# EAGLE design W032B (EAGLE 6.6.0)
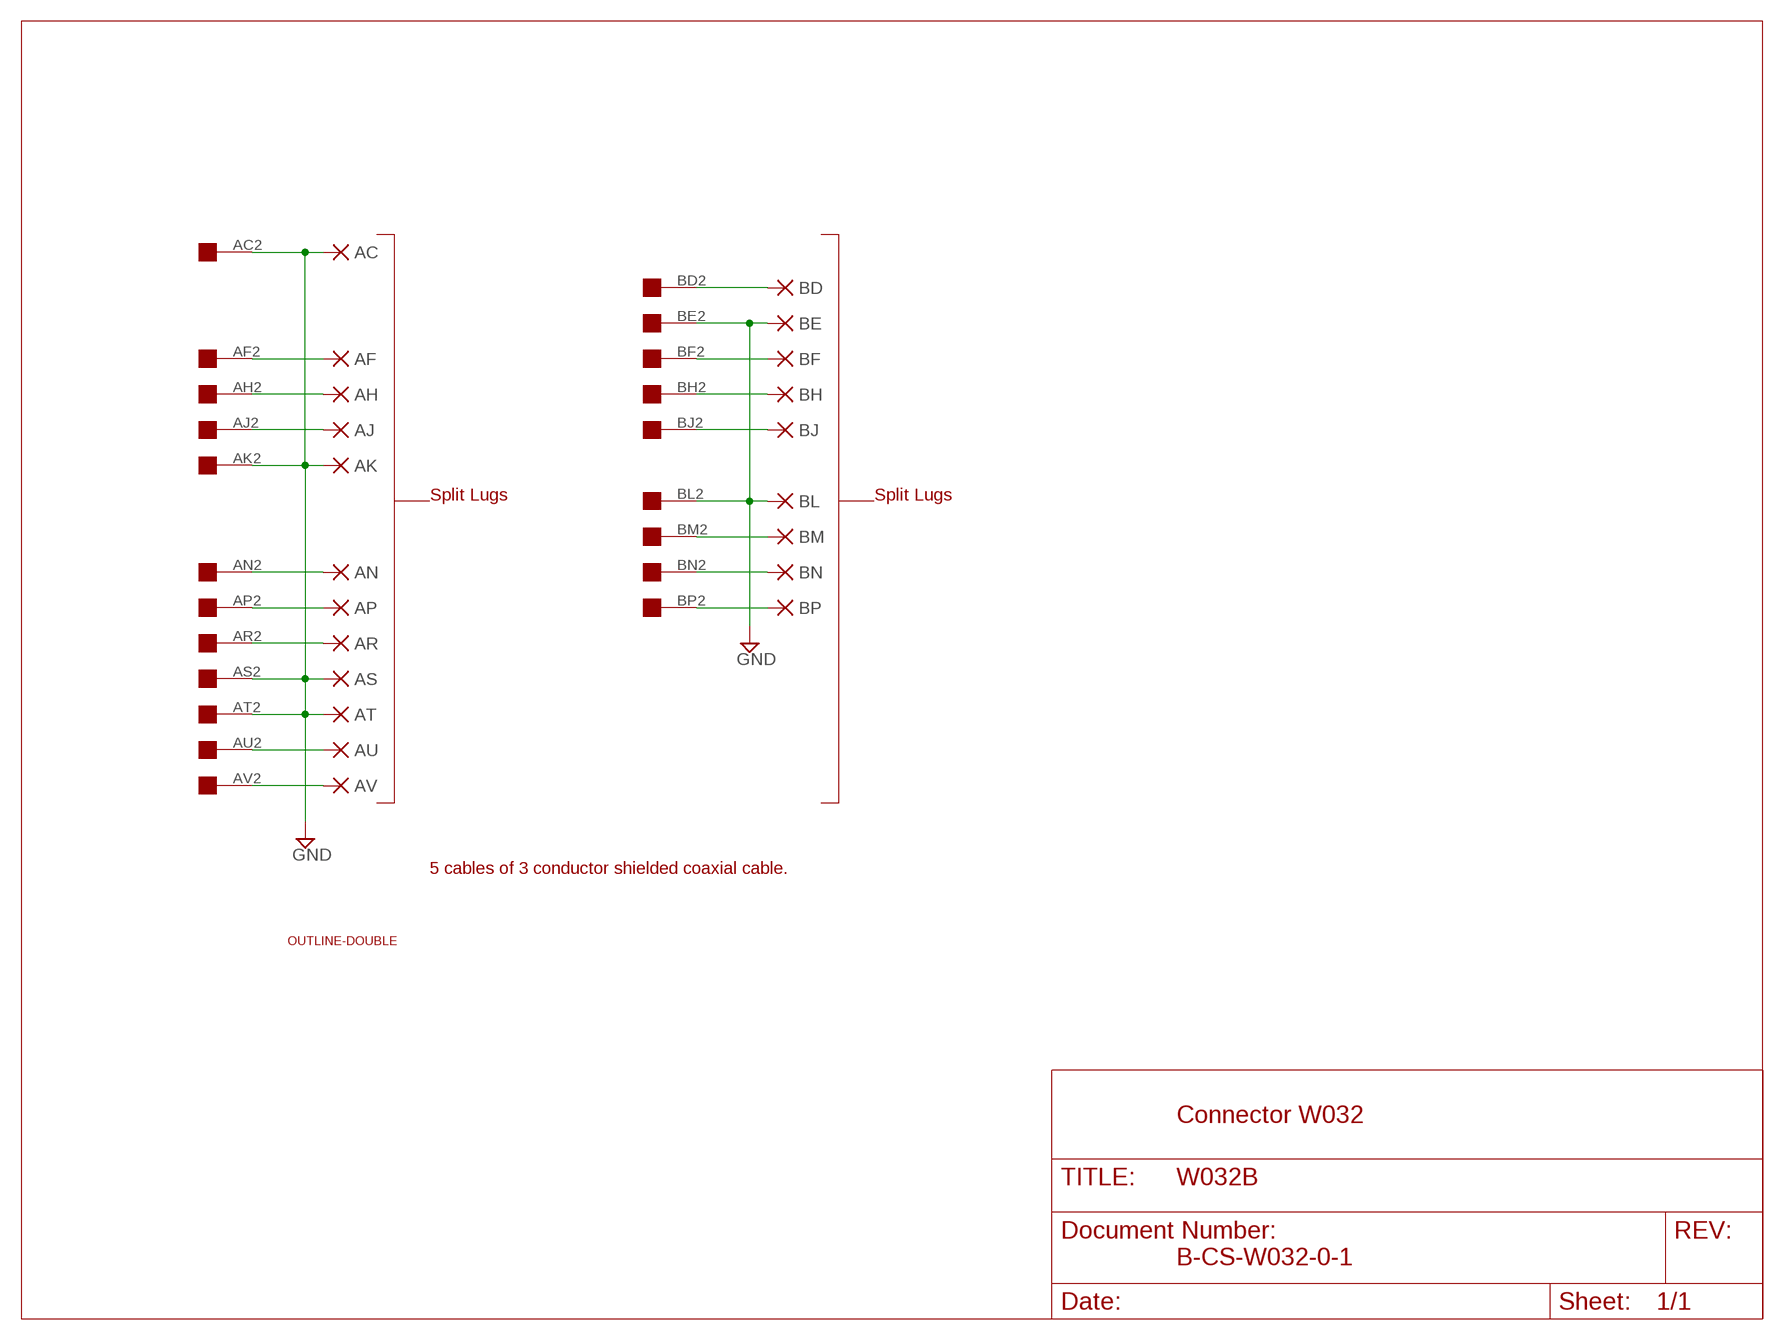
[diagram p0: schematic, sheet 1]

## Parts
AC  PAD-0465  [0465]
AF  PAD-0465  [0465]
AH  PAD-0465  [0465]
AJ  PAD-0465  [0465]
AK  PAD-0465  [0465]
AN  PAD-0465  [0465]
AP  PAD-0465  [0465]
AR  PAD-0465  [0465]
AS  PAD-0465  [0465]
AT  PAD-0465  [0465]
AU  PAD-0465  [0465]
AV  PAD-0465  [0465]
BD  PAD-0465  [0465]
BE  PAD-0465  [0465]
BF  PAD-0465  [0465]
BH  PAD-0465  [0465]
BJ  PAD-0465  [0465]
BL  PAD-0465  [0465]
BM  PAD-0465  [0465]
BN  PAD-0465  [0465]
BP  PAD-0465  [0465]
U$1  OUTLINE-DOUBLE  [DOUBLE]
U$3  DOUBLE  [EDGE-CON4]

## Nets
GND: AC.P$1(P) AK.P$1(P) AS.P$1(P) AT.P$1(P) BE.P$1(P) BL.P$1(P) U$3.AC2 U$3.AK2 U$3.AS2 U$3.AT2 U$3.BE2 U$3.BL2
N$2: BH.P$1(P) U$3.BH2
N$4: BM.P$1(P) U$3.BM2
N$5: BP.P$1(P) U$3.BP2
N$9: BD.P$1(P) U$3.BD2
N$14: AH.P$1(P) U$3.AH2
N$15: BF.P$1(P) U$3.BF2
N$16: BJ.P$1(P) U$3.BJ2
N$18: BN.P$1(P) U$3.BN2
N$23: AP.P$1(P) U$3.AP2
N$29: AF.P$1(P) U$3.AF2
N$30: AJ.P$1(P) U$3.AJ2
N$32: AN.P$1(P) U$3.AN2
N$33: AR.P$1(P) U$3.AR2
N$34: AU.P$1(P) U$3.AU2
N$35: AV.P$1(P) U$3.AV2
Unconnected: U$3.AA1 U$3.AA2 U$3.AB1 U$3.AB2 U$3.AC1 U$3.AD1 U$3.AD2 U$3.AE1 U$3.AE2 U$3.AF1 U$3.AH1 U$3.AJ1 U$3.AK1 U$3.AL1 U$3.AL2 U$3.AM1 U$3.AM2 U$3.AN1 U$3.AP1 U$3.AR1 U$3.AS1 U$3.AT1 U$3.AU1 U$3.AV1 U$3.BA1 U$3.BA2 U$3.BB1 U$3.BB2 U$3.BC1 U$3.BC2 U$3.BD1 U$3.BE1 U$3.BF1 U$3.BH1 U$3.BJ1 U$3.BK1 U$3.BK2 U$3.BL1 U$3.BM1 U$3.BN1 U$3.BP1 U$3.BR1 U$3.BR2 U$3.BS1 U$3.BS2 U$3.BT1 U$3.BT2 U$3.BU1 U$3.BU2 U$3.BV1 U$3.BV2

## Notes on the sheet
- Split Lugs | Split Lugs
- 5 cables of 3 conductor shielded coaxial cable.
- Connector W032
- B-CS-W032-0-1

## Library data of the parts
AC AF AH AJ AK AN AP AR AS AT AU AV BD BE BF BH BJ BL BM BN BP = dec-con:PAD: WIRE PAD Standard US Drill Sizes
U$1 = dec-con:OUTLINE-*: Board outlines for DEC boards.
U$3 = dec-con:DOUBLE: Double-Height DEC board

## Net classes
1 Supply: width 0.813 mm

## Board
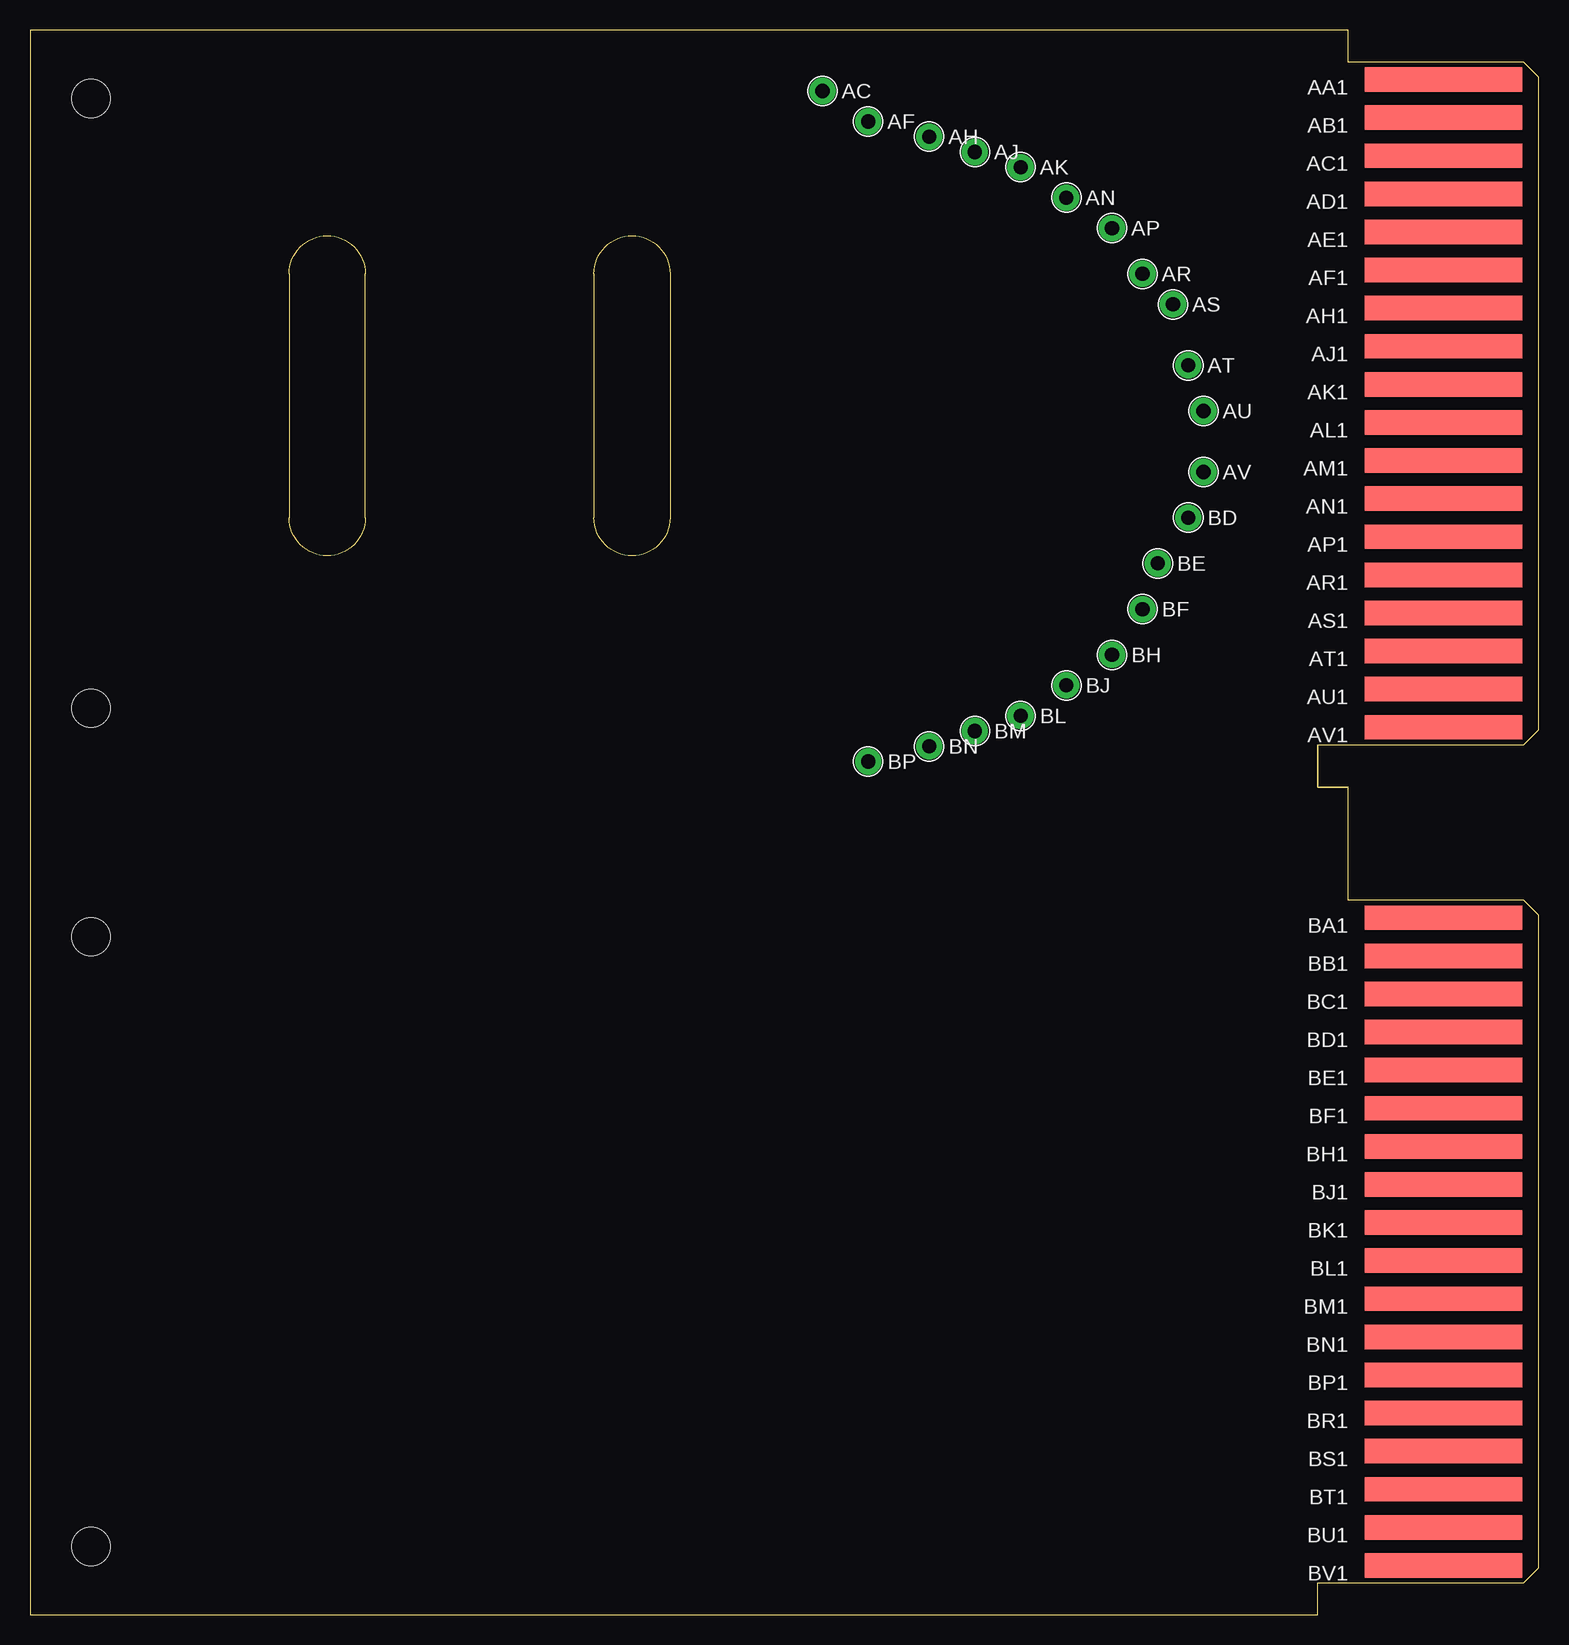
[diagram p1: board, top side]
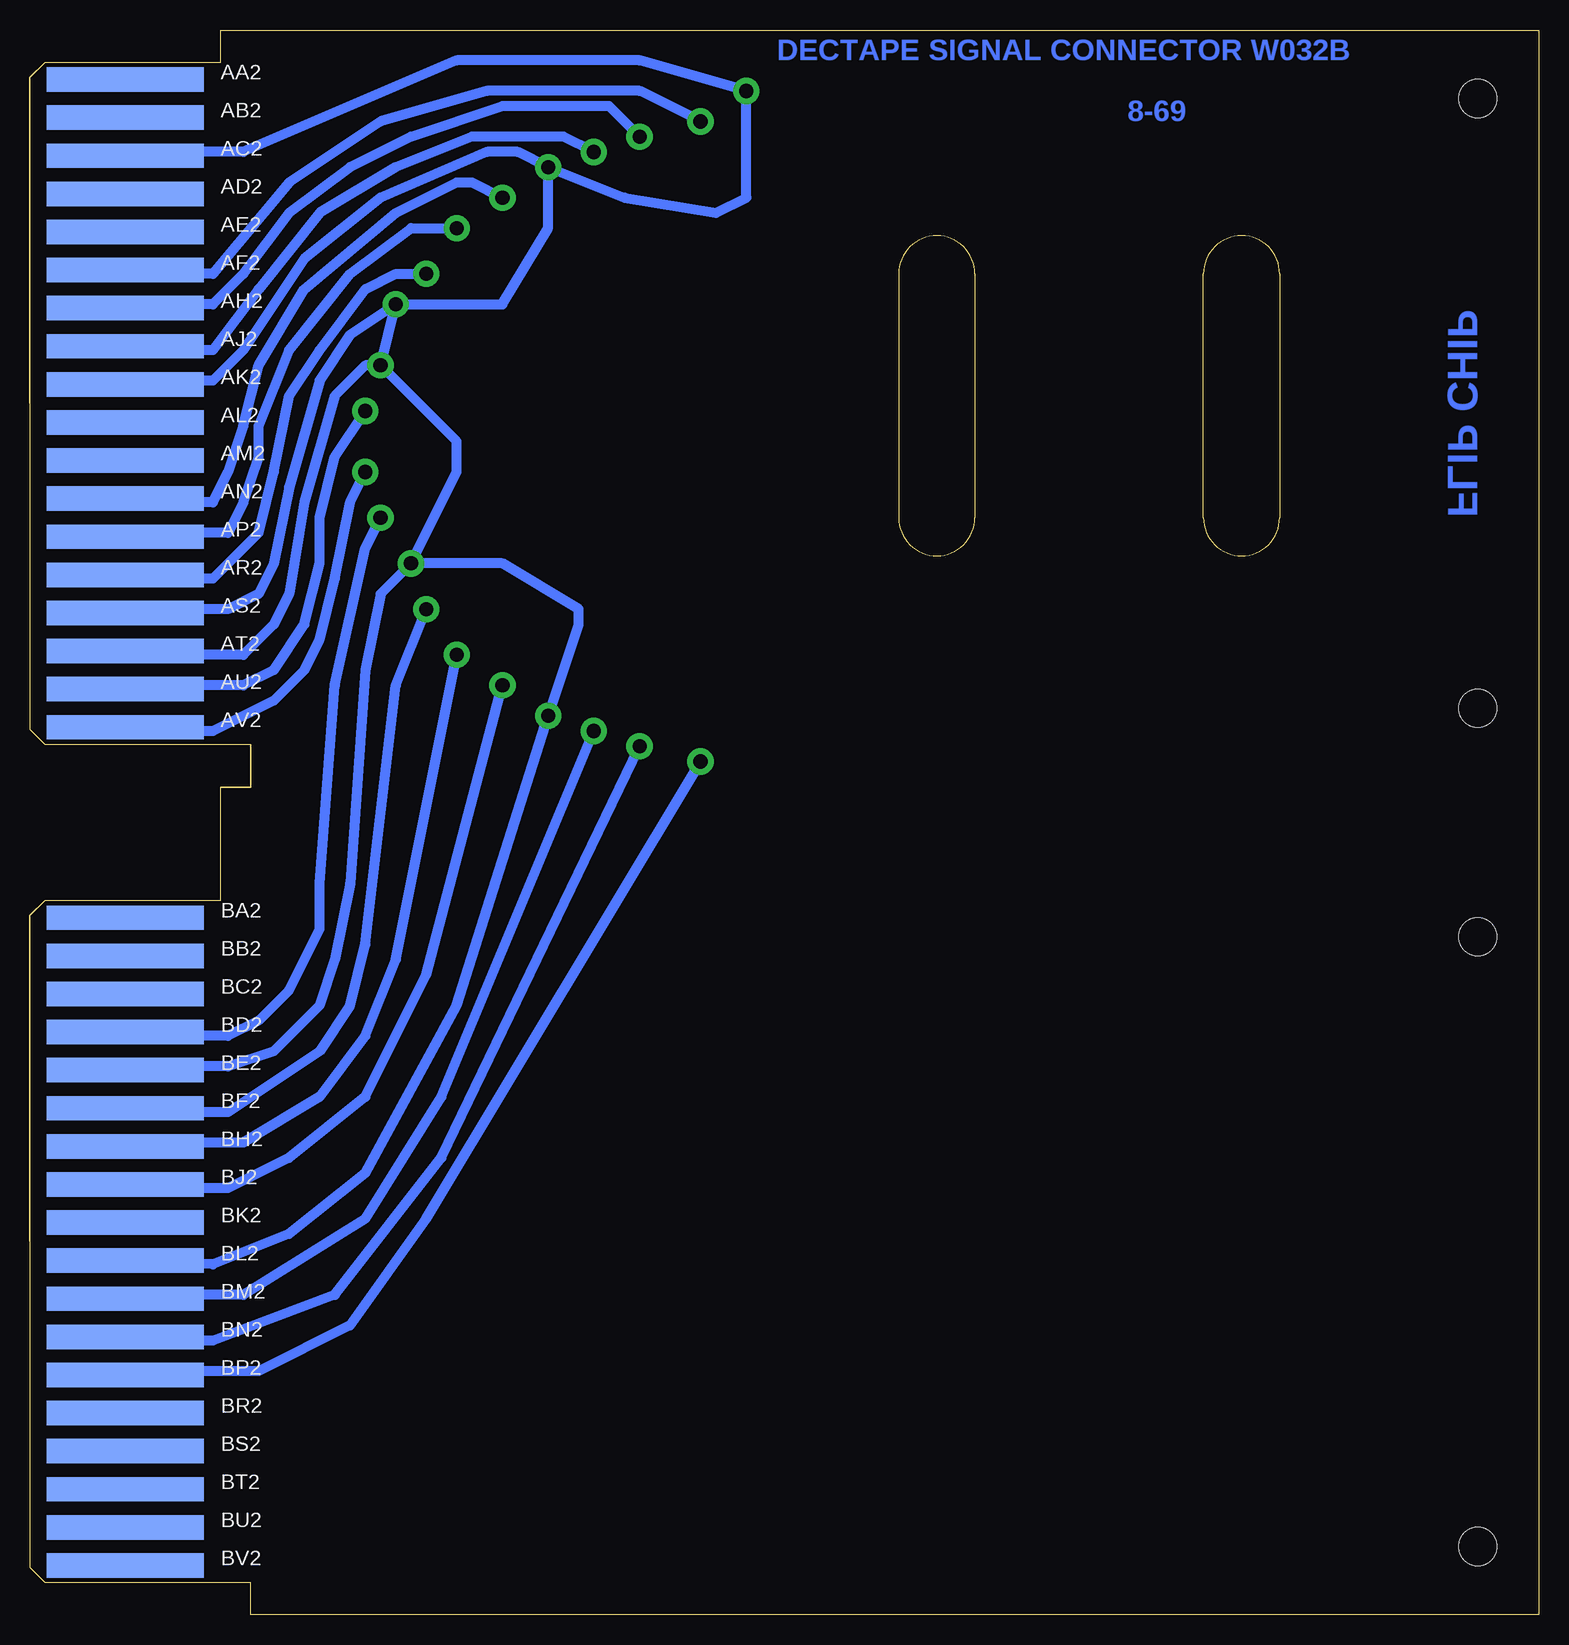
[diagram p2: board, bottom side, seen from below]

Size 125.73 x 132.08 mm. Coordinates in mm from the lower left corner, seen from the top.
Outline: 21.59,111.76 arc-180 27.94,111.76 27.94,91.44 arc-180 21.59,91.44 21.59,111.76
Outline: 46.99,111.76 arc-180 53.34,111.76 53.34,91.44 arc-180 46.99,91.44 46.99,111.76
Copper layers (1+16): Top 0.035mm / dielectric 1.5mm / Bottom 0.035mm
Design rules "16mils": minimum track width 16mil, minimum drill 32mil, track to track 15mil, track to pad 10mil, pad to pad 10mil, via to via 10mil, smd to smd 10mil, copper to edge 13mil, drill to drill 10mil, minimum pad ring 10mil, minimum via ring 8mil, stop-mask expansion 0mil, vias tented up to drill 0mil, thermal gap 10mil

### Footprints (pad centres in the part's own frame; a part is rotated, then mirrored left to right if it is on the bottom)
0465 = drill 1.181 pad 2.184: P$1 0,0
DOUBLE = hole 3.175: 120.65,56.515; 120.65,5.715; 120.65,75.565; 120.65,126.365
EDGE-CON4 = smd 13.106 x 2.032: AA1 7.938,4.128; AB1 7.938,7.303; AC1 7.938,10.477; AD1 7.938,13.652; AE1 7.938,16.828; AF1 7.938,20.003; AH1 7.938,23.177; AJ1 7.938,26.352; AK1 7.938,29.527; AL1 7.938,32.703; AM1 7.938,35.877; AN1 7.938,39.053; AP1 7.938,42.227; AR1 7.938,45.403; AS1 7.938,48.578; AT1 7.938,51.752; AU1 7.938,54.928; AV1 7.938,58.102; BA1 7.938,73.978; BB1 7.938,77.153; BC1 7.938,80.328; BD1 7.938,83.502; BE1 7.938,86.677; BF1 7.938,89.853; BH1 7.938,93.028; BJ1 7.938,96.203; BK1 7.938,99.377; BL1 7.938,102.552; BM1 7.938,105.728; BN1 7.938,108.903; BP1 7.938,112.078; BR1 7.938,115.252; BS1 7.938,118.427; BT1 7.938,121.603; BU1 7.938,124.778; BV1 7.938,127.953 | smd 13.106 x 2.032 bottom: AA2 7.938,4.128; AB2 7.938,7.303; AC2 7.938,10.477; AD2 7.938,13.652; AE2 7.938,16.828; AF2 7.938,20.003; AH2 7.938,23.177; AJ2 7.938,26.352; AK2 7.938,29.527; AL2 7.938,32.703; AM2 7.938,35.877; AN2 7.938,39.053; AP2 7.938,42.227; AR2 7.938,45.403; AS2 7.938,48.578; AT2 7.938,51.752; AU2 7.938,54.928; AV2 7.938,58.102; BA2 7.938,73.978; BB2 7.938,77.153; BC2 7.938,80.328; BD2 7.938,83.502; BE2 7.938,86.677; BF2 7.938,89.853; BH2 7.938,93.028; BJ2 7.938,96.203; BK2 7.938,99.377; BL2 7.938,102.552; BM2 7.938,105.728; BN2 7.938,108.903; BP2 7.938,112.078; BR2 7.938,115.252; BS2 7.938,118.427; BT2 7.938,121.603; BU2 7.938,124.778; BV2 7.938,127.953

### Placement (x,y rotation side)
AC  66.04,127 0 top
AF  69.85,124.46 0 top
AH  74.93,123.19 0 top
AJ  78.74,121.92 0 top
AK  82.55,120.65 0 top
AN  86.36,118.11 0 top
AP  90.17,115.57 0 top
AR  92.71,111.76 0 top
AS  95.25,109.22 0 top
AT  96.52,104.14 0 top
AU  97.79,100.33 0 top
AV  97.79,95.25 0 top
BD  96.52,91.44 0 top
BE  93.98,87.63 0 top
BF  92.71,83.82 0 top
BH  90.17,80.01 0 top
BJ  86.36,77.47 0 top
BL  82.55,74.93 0 top
BM  78.74,73.66 0 top
BN  74.93,72.39 0 top
BP  69.85,71.12 0 top
U$1  125.73,132.08 180 top
U$3  125.73,132.08 180 top

### Tracks (layer width: path | path; a pad name or v marks a point on that pad's centre or on a via)
GND
  Bottom 0.813: U$3.AC2 116.84,121.92 107.95,121.92 90.17,129.54 74.93,129.54 AC.P$1 66.04,118.11 68.58,116.84 76.2,118.11 AK.P$1 | AS.P$1 86.36,109.22 82.55,115.57 AK.P$1 | AT.P$1 AS.P$1 | BE.P$1 90.17,95.25 90.17,97.79 AT.P$1 | BE.P$1 86.36,87.63 80.01,83.82 80.01,82.55 BL.P$1 90.17,50.8 97.79,36.83 104.14,31.75 110.49,29.21 U$3.BL2 | U$3.BE2 116.84,45.72 109.22,45.72 105.41,46.99 101.6,50.8 100.33,54.61 99.06,60.96 97.79,78.74 96.52,85.09 BE.P$1 | U$3.AK2 116.84,102.87 110.49,102.87 107.95,105.41 102.87,113.03 96.52,118.11 87.63,121.92 85.09,121.92 AK.P$1 | U$3.AT2 116.84,80.01 107.95,80.01 105.41,82.55 104.14,85.09 102.87,92.71 100.33,101.6 97.79,104.14 AT.P$1 | U$3.AS2 116.84,83.82 109.22,83.82 106.68,85.09 105.41,87.63 104.14,93.98 101.6,102.87 99.06,106.68 AS.P$1
N$2
  Bottom 0.813: U$3.BH2 116.84,39.37 107.95,39.37 101.6,43.18 97.79,48.26 95.25,54.61 BH.P$1
N$4
  Bottom 0.813: U$3.BM2 116.84,26.67 107.95,26.67 97.79,33.02 91.44,43.18 BM.P$1
N$5
  Bottom 0.813: U$3.BP2 116.84,20.32 106.68,20.32 99.06,24.13 92.71,33.02 BP.P$1
N$9
  Bottom 0.813: U$3.BD2 116.84,48.26 109.22,48.26 106.68,49.53 104.14,52.07 101.6,57.15 101.6,60.96 100.33,77.47 97.79,88.9 BD.P$1
N$14
  Bottom 0.813: U$3.AH2 116.84,109.22 110.49,109.22 107.95,111.76 104.14,116.84 99.06,120.65 93.98,123.19 86.36,125.73 77.47,125.73 AH.P$1
N$15
  Bottom 0.813: U$3.BF2 116.84,41.91 109.22,41.91 101.6,46.99 99.06,50.8 97.79,55.88 95.25,77.47 BF.P$1
N$16
  Bottom 0.813: U$3.BJ2 116.84,35.56 109.22,35.56 104.14,38.1 97.79,43.18 92.71,53.34 BJ.P$1
N$18
  Bottom 0.813: U$3.BN2 116.84,22.86 110.49,22.86 100.33,26.67 91.44,38.1 BN.P$1
N$23
  Bottom 0.813: U$3.AP2 116.84,90.17 109.22,90.17 107.95,92.71 106.68,96.52 106.68,99.06 104.14,105.41 99.06,111.76 93.98,115.57 AP.P$1
N$29
  Bottom 0.813: U$3.AF2 116.84,111.76 110.49,111.76 104.14,119.38 96.52,124.46 87.63,127 74.93,127 AF.P$1
N$30
  Bottom 0.813: U$3.AJ2 116.84,105.41 110.49,105.41 106.68,110.49 101.6,116.84 95.25,120.65 88.9,123.19 81.28,123.19 AJ.P$1
N$32
  Bottom 0.813: U$3.AN2 116.84,92.71 110.49,92.71 109.22,95.25 107.95,99.06 106.68,104.14 102.87,110.49 95.25,116.84 90.17,119.38 88.9,119.38 AN.P$1
N$33
  Bottom 0.813: U$3.AR2 116.84,86.36 110.49,86.36 106.68,90.17 105.41,95.25 104.14,101.6 101.6,105.41 97.79,110.49 95.25,111.76 AR.P$1
N$34
  Bottom 0.813: U$3.AU2 116.84,77.47 107.95,77.47 105.41,78.74 102.87,82.55 101.6,87.63 101.6,91.44 100.33,96.52 AU.P$1
N$35
  Bottom 0.813: U$3.AV2 116.84,73.66 110.49,73.66 105.41,76.2 102.87,78.74 101.6,81.28 100.33,86.36 99.06,92.71 AV.P$1

### Text on the board
Bottom: DECTAPE SIGNAL CONNECTOR W032B | 8-69 | FLIP CHIP